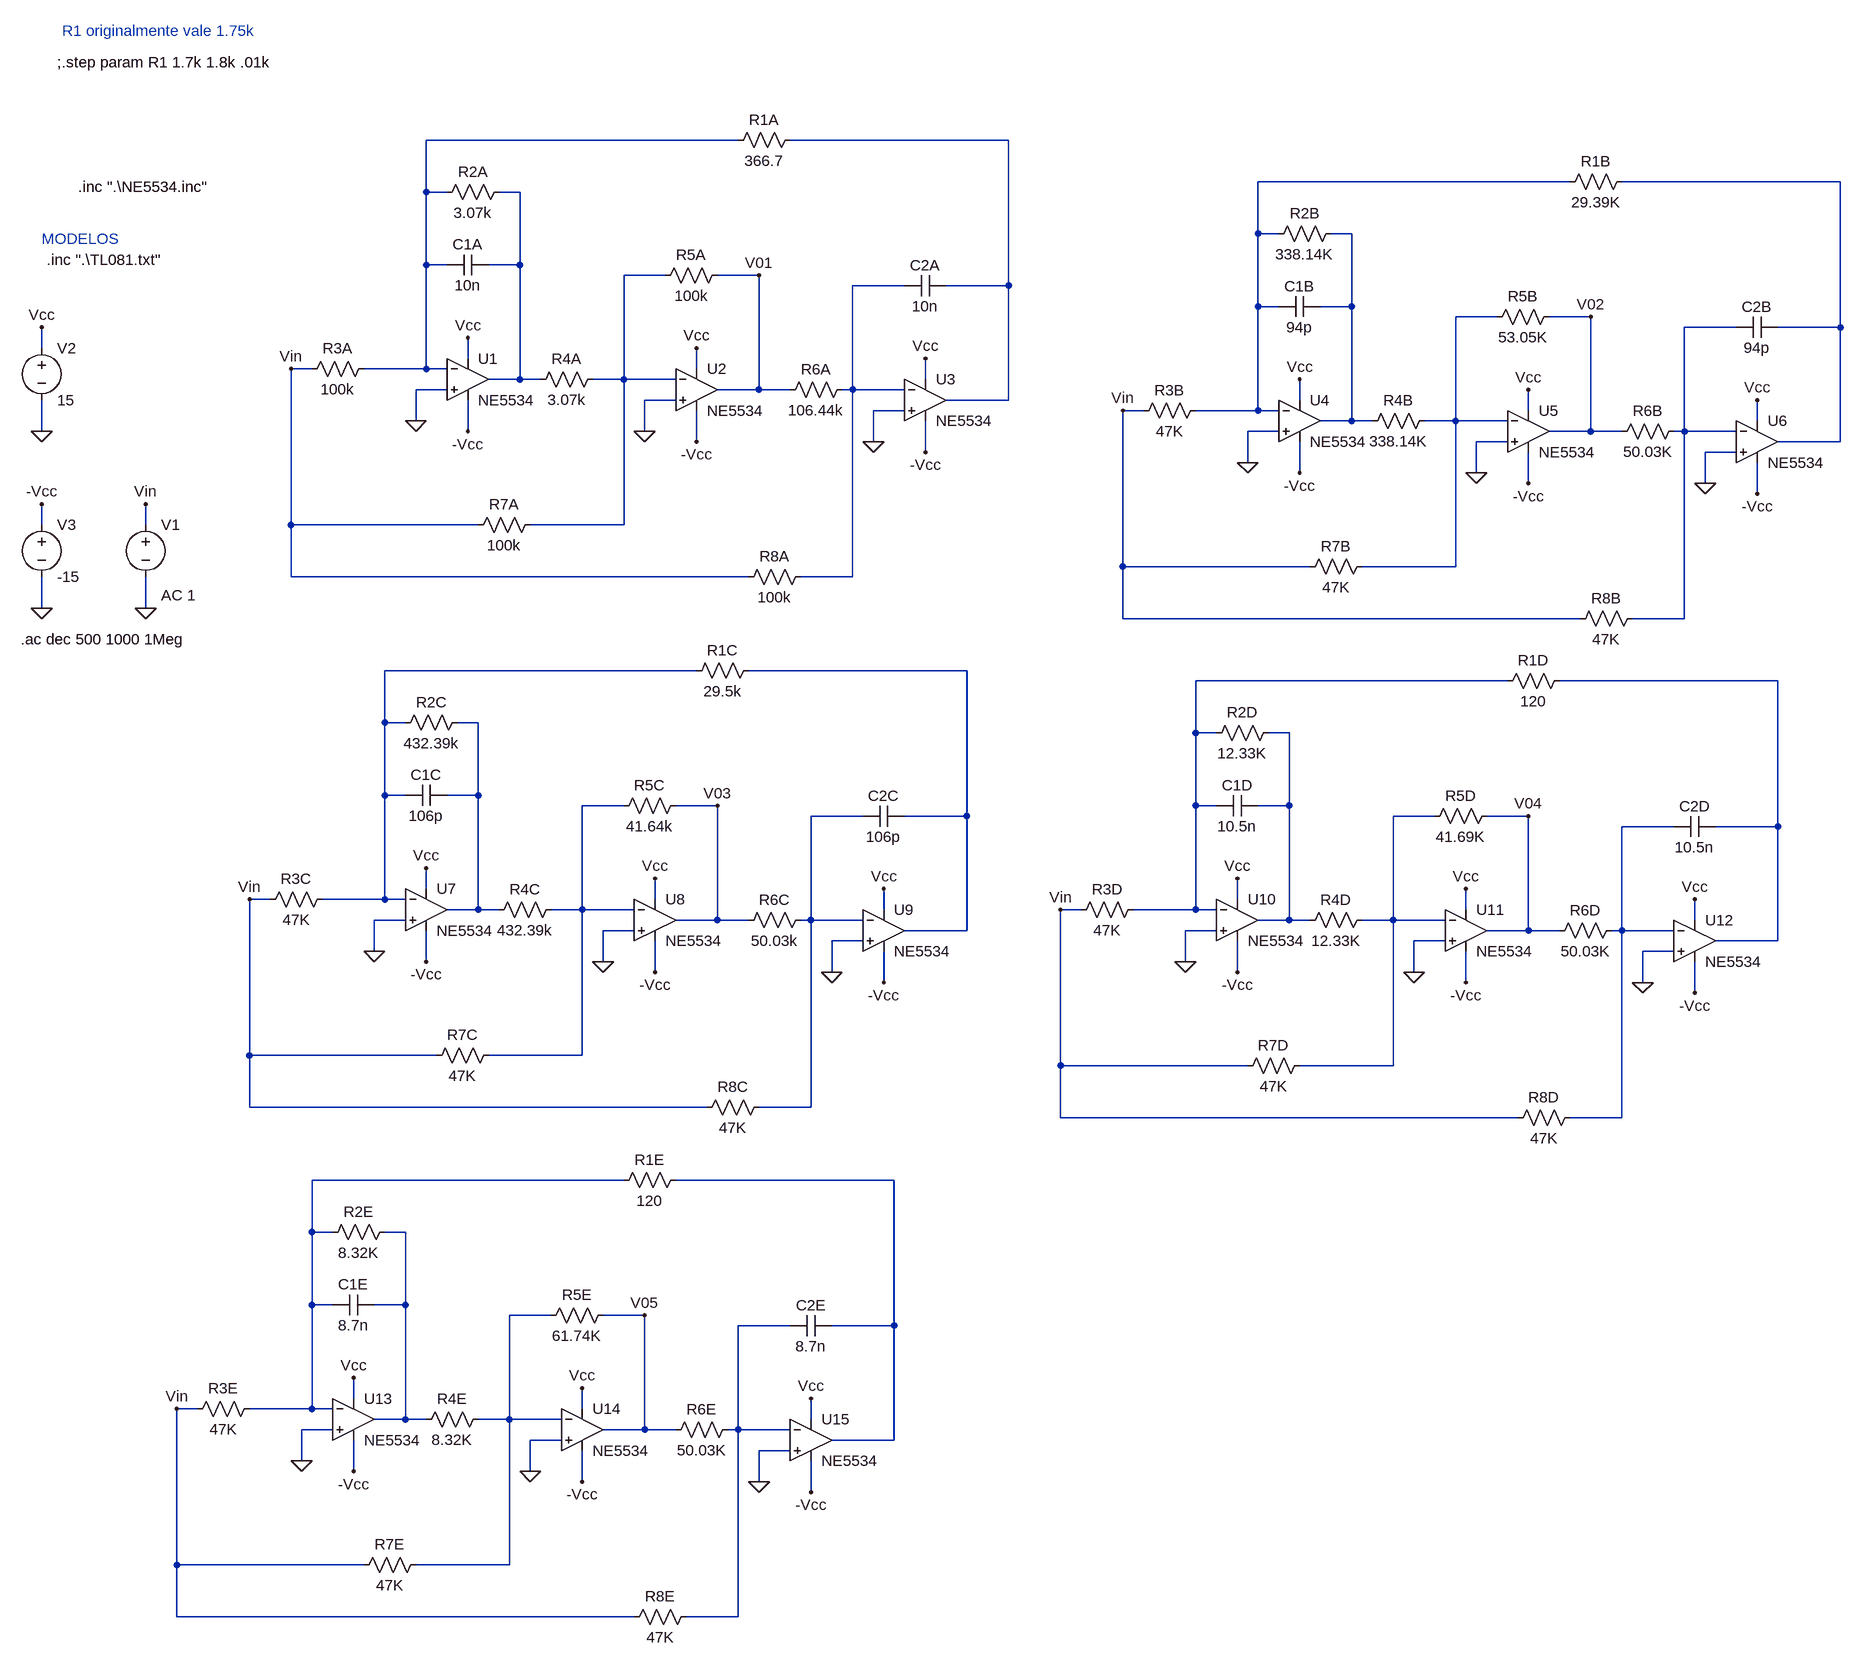
[diagram p0: schematic FT-TL081.asc]
FT-TL081.asc, the LTspice schematic file:
Version 4
SHEET 1 2736 1840
WIRE 800 -480 320 -480
WIRE 1216 -480 880 -480
WIRE 2080 -416 1600 -416
WIRE 2496 -416 2160 -416
WIRE 320 -400 320 -480
WIRE 352 -400 320 -400
WIRE 464 -400 432 -400
WIRE 1600 -336 1600 -416
WIRE 1632 -336 1600 -336
WIRE 1744 -336 1712 -336
WIRE 320 -288 320 -400
WIRE 352 -288 320 -288
WIRE 464 -288 464 -400
WIRE 464 -288 416 -288
WIRE 688 -272 624 -272
WIRE 832 -272 768 -272
WIRE 1056 -256 976 -256
WIRE 1216 -256 1216 -480
WIRE 1216 -256 1120 -256
WIRE 1600 -224 1600 -336
WIRE 1632 -224 1600 -224
WIRE 1744 -224 1744 -336
WIRE 1744 -224 1696 -224
WIRE 1968 -208 1904 -208
WIRE 2112 -208 2048 -208
WIRE 2336 -192 2256 -192
WIRE 2496 -192 2496 -416
WIRE 2496 -192 2400 -192
WIRE -272 -160 -272 -192
WIRE 384 -144 384 -176
WIRE 144 -128 112 -128
WIRE 320 -128 320 -288
WIRE 320 -128 224 -128
WIRE 352 -128 320 -128
WIRE 736 -128 736 -160
WIRE 464 -112 464 -288
WIRE 464 -112 416 -112
WIRE 496 -112 464 -112
WIRE 624 -112 624 -272
WIRE 624 -112 576 -112
WIRE 704 -112 624 -112
WIRE 1088 -112 1088 -144
WIRE 352 -96 304 -96
WIRE 832 -96 832 -272
WIRE 832 -96 768 -96
WIRE 880 -96 832 -96
WIRE 976 -96 976 -256
WIRE 976 -96 960 -96
WIRE 1056 -96 976 -96
WIRE 704 -80 656 -80
WIRE 1216 -80 1216 -256
WIRE 1216 -80 1120 -80
WIRE 1664 -80 1664 -112
WIRE 1056 -64 1008 -64
WIRE 1424 -64 1392 -64
WIRE 1600 -64 1600 -224
WIRE 1600 -64 1504 -64
WIRE 1632 -64 1600 -64
WIRE 2016 -64 2016 -96
WIRE 304 -48 304 -96
WIRE 1744 -48 1744 -224
WIRE 1744 -48 1696 -48
WIRE 1776 -48 1744 -48
WIRE 1904 -48 1904 -208
WIRE 1904 -48 1856 -48
WIRE 1984 -48 1904 -48
WIRE 2368 -48 2368 -80
WIRE -272 -32 -272 -80
WIRE 384 -32 384 -80
WIRE 656 -32 656 -80
WIRE 1632 -32 1584 -32
WIRE 2112 -32 2112 -208
WIRE 2112 -32 2048 -32
WIRE 2160 -32 2112 -32
WIRE 2256 -32 2256 -192
WIRE 2256 -32 2240 -32
WIRE 2336 -32 2256 -32
WIRE 736 -16 736 -64
WIRE 1008 -16 1008 -64
WIRE 1984 -16 1936 -16
WIRE 2496 -16 2496 -192
WIRE 2496 -16 2400 -16
WIRE 1088 0 1088 -48
WIRE 2336 0 2288 0
WIRE 1584 16 1584 -32
WIRE 1664 32 1664 -16
WIRE 1936 32 1936 -16
WIRE 2016 48 2016 0
WIRE 2288 48 2288 0
WIRE 2368 64 2368 16
WIRE -272 112 -272 80
WIRE -112 112 -112 80
WIRE 112 112 112 -128
WIRE 400 112 112 112
WIRE 624 112 624 -112
WIRE 624 112 480 112
WIRE 1392 176 1392 -64
WIRE 1680 176 1392 176
WIRE 1904 176 1904 -48
WIRE 1904 176 1760 176
WIRE 112 192 112 112
WIRE 816 192 112 192
WIRE 976 192 976 -96
WIRE 976 192 896 192
WIRE -272 240 -272 192
WIRE -112 240 -112 192
WIRE 1392 256 1392 176
WIRE 2096 256 1392 256
WIRE 2256 256 2256 -32
WIRE 2256 256 2176 256
WIRE 736 336 256 336
WIRE 1152 336 816 336
WIRE 1984 352 1504 352
WIRE 2400 352 2064 352
WIRE 256 416 256 336
WIRE 288 416 256 416
WIRE 400 416 368 416
WIRE 1504 432 1504 352
WIRE 1536 432 1504 432
WIRE 1648 432 1616 432
WIRE 256 528 256 416
WIRE 288 528 256 528
WIRE 400 528 400 416
WIRE 400 528 352 528
WIRE 624 544 560 544
WIRE 768 544 704 544
WIRE 1504 544 1504 432
WIRE 1536 544 1504 544
WIRE 1648 544 1648 432
WIRE 1648 544 1600 544
WIRE 992 560 912 560
WIRE 1152 560 1152 336
WIRE 1152 560 1056 560
WIRE 1872 560 1808 560
WIRE 2016 560 1952 560
WIRE 2240 576 2160 576
WIRE 2400 576 2400 352
WIRE 2400 576 2304 576
WIRE 320 672 320 640
WIRE 80 688 48 688
WIRE 256 688 256 528
WIRE 256 688 160 688
WIRE 288 688 256 688
WIRE 672 688 672 656
WIRE 1568 688 1568 656
WIRE 400 704 400 528
WIRE 400 704 352 704
WIRE 432 704 400 704
WIRE 560 704 560 544
WIRE 560 704 512 704
WIRE 640 704 560 704
WIRE 1024 704 1024 672
WIRE 1328 704 1296 704
WIRE 1504 704 1504 544
WIRE 1504 704 1408 704
WIRE 1536 704 1504 704
WIRE 1920 704 1920 672
WIRE 288 720 240 720
WIRE 768 720 768 544
WIRE 768 720 704 720
WIRE 816 720 768 720
WIRE 912 720 912 560
WIRE 912 720 896 720
WIRE 992 720 912 720
WIRE 1648 720 1648 544
WIRE 1648 720 1600 720
WIRE 1680 720 1648 720
WIRE 1808 720 1808 560
WIRE 1808 720 1760 720
WIRE 1888 720 1808 720
WIRE 2272 720 2272 688
WIRE 640 736 592 736
WIRE 1152 736 1152 560
WIRE 1152 736 1056 736
WIRE 1536 736 1488 736
WIRE 2016 736 2016 560
WIRE 2016 736 1952 736
WIRE 2064 736 2016 736
WIRE 2160 736 2160 576
WIRE 2160 736 2144 736
WIRE 2240 736 2160 736
WIRE 992 752 944 752
WIRE 1888 752 1840 752
WIRE 2400 752 2400 576
WIRE 2400 752 2304 752
WIRE 240 768 240 720
WIRE 2240 768 2192 768
WIRE 320 784 320 736
WIRE 592 784 592 736
WIRE 1488 784 1488 736
WIRE 672 800 672 752
WIRE 944 800 944 752
WIRE 1568 800 1568 752
WIRE 1840 800 1840 752
WIRE 1024 816 1024 768
WIRE 1920 816 1920 768
WIRE 2192 816 2192 768
WIRE 2272 832 2272 784
WIRE 48 928 48 688
WIRE 336 928 48 928
WIRE 560 928 560 704
WIRE 560 928 416 928
WIRE 1296 944 1296 704
WIRE 1584 944 1296 944
WIRE 1808 944 1808 720
WIRE 1808 944 1664 944
WIRE 48 1008 48 928
WIRE 752 1008 48 1008
WIRE 912 1008 912 720
WIRE 912 1008 832 1008
WIRE 1296 1024 1296 944
WIRE 2000 1024 1296 1024
WIRE 2160 1024 2160 736
WIRE 2160 1024 2080 1024
WIRE 624 1120 144 1120
WIRE 1040 1120 704 1120
WIRE 144 1200 144 1120
WIRE 176 1200 144 1200
WIRE 288 1200 256 1200
WIRE 144 1312 144 1200
WIRE 176 1312 144 1312
WIRE 288 1312 288 1200
WIRE 288 1312 240 1312
WIRE 512 1328 448 1328
WIRE 656 1328 592 1328
WIRE 880 1344 800 1344
WIRE 1040 1344 1040 1120
WIRE 1040 1344 944 1344
WIRE 208 1456 208 1424
WIRE -32 1472 -64 1472
WIRE 144 1472 144 1312
WIRE 144 1472 48 1472
WIRE 176 1472 144 1472
WIRE 560 1472 560 1440
WIRE 288 1488 288 1312
WIRE 288 1488 240 1488
WIRE 320 1488 288 1488
WIRE 448 1488 448 1328
WIRE 448 1488 400 1488
WIRE 528 1488 448 1488
WIRE 912 1488 912 1456
WIRE 176 1504 128 1504
WIRE 656 1504 656 1328
WIRE 656 1504 592 1504
WIRE 704 1504 656 1504
WIRE 800 1504 800 1344
WIRE 800 1504 784 1504
WIRE 880 1504 800 1504
WIRE 528 1520 480 1520
WIRE 1040 1520 1040 1344
WIRE 1040 1520 944 1520
WIRE 880 1536 832 1536
WIRE 128 1552 128 1504
WIRE 208 1568 208 1520
WIRE 480 1568 480 1520
WIRE 560 1584 560 1536
WIRE 832 1584 832 1536
WIRE 912 1600 912 1552
WIRE -64 1712 -64 1472
WIRE 224 1712 -64 1712
WIRE 448 1712 448 1488
WIRE 448 1712 304 1712
WIRE -64 1792 -64 1712
WIRE 640 1792 -64 1792
WIRE 800 1792 800 1504
WIRE 800 1792 720 1792
FLAG -272 80 -Vcc
FLAG -272 -192 Vcc
FLAG -272 -32 0
FLAG -272 240 0
FLAG 384 -176 Vcc
FLAG 384 -32 -Vcc
FLAG 304 -48 0
FLAG 736 -160 Vcc
FLAG 736 -16 -Vcc
FLAG 656 -32 0
FLAG 1088 -144 Vcc
FLAG 1088 0 -Vcc
FLAG 1008 -16 0
FLAG -112 240 0
FLAG -112 80 Vin
FLAG 112 -128 Vin
FLAG 832 -272 V01
FLAG 1664 -112 Vcc
FLAG 1664 32 -Vcc
FLAG 1584 16 0
FLAG 2016 -96 Vcc
FLAG 2016 48 -Vcc
FLAG 1936 32 0
FLAG 2368 -80 Vcc
FLAG 2368 64 -Vcc
FLAG 2288 48 0
FLAG 1392 -64 Vin
FLAG 2112 -208 V02
FLAG 320 640 Vcc
FLAG 320 784 -Vcc
FLAG 240 768 0
FLAG 672 656 Vcc
FLAG 672 800 -Vcc
FLAG 592 784 0
FLAG 1024 672 Vcc
FLAG 1024 816 -Vcc
FLAG 944 800 0
FLAG 48 688 Vin
FLAG 768 544 V03
FLAG 1568 656 Vcc
FLAG 1568 800 -Vcc
FLAG 1488 784 0
FLAG 1920 672 Vcc
FLAG 1920 816 -Vcc
FLAG 1840 800 0
FLAG 2272 688 Vcc
FLAG 2272 832 -Vcc
FLAG 2192 816 0
FLAG 1296 704 Vin
FLAG 2016 560 V04
FLAG 208 1424 Vcc
FLAG 208 1568 -Vcc
FLAG 128 1552 0
FLAG 560 1440 Vcc
FLAG 560 1584 -Vcc
FLAG 480 1568 0
FLAG 912 1456 Vcc
FLAG 912 1600 -Vcc
FLAG 832 1584 0
FLAG -64 1472 Vin
FLAG 656 1328 V05
SYMBOL voltage -272 -176 R0
SYMATTR InstName V2
SYMATTR Value 15
SYMBOL voltage -272 96 R0
SYMATTR InstName V3
SYMATTR Value -15
SYMBOL Opamps\\opamp2 384 -176 R0
SYMATTR InstName U1
SYMATTR Value NE5534
SYMBOL cap 416 -304 R90
WINDOW 0 0 32 VBottom 2
WINDOW 3 32 32 VTop 2
SYMATTR InstName C1A
SYMATTR Value 10n
SYMBOL res 896 -496 R90
WINDOW 0 0 56 VBottom 2
WINDOW 3 32 56 VTop 2
SYMATTR InstName R1A
SYMATTR Value 366.7
SYMBOL res 448 -416 R90
WINDOW 0 0 56 VBottom 2
WINDOW 3 32 56 VTop 2
SYMATTR InstName R2A
SYMATTR Value 3.07k
SYMBOL res 240 -144 R90
WINDOW 0 0 56 VBottom 2
WINDOW 3 32 56 VTop 2
SYMATTR InstName R3A
SYMATTR Value 100k
SYMBOL res 592 -128 R90
WINDOW 0 0 56 VBottom 2
WINDOW 3 32 56 VTop 2
SYMATTR InstName R4A
SYMATTR Value 3.07k
SYMBOL res 784 -288 R90
WINDOW 0 0 56 VBottom 2
WINDOW 3 32 56 VTop 2
SYMATTR InstName R5A
SYMATTR Value 100k
SYMBOL res 976 -112 R90
WINDOW 0 0 56 VBottom 2
WINDOW 3 32 56 VTop 2
SYMATTR InstName R6A
SYMATTR Value 106.44k
SYMBOL res 496 96 R90
WINDOW 0 0 56 VBottom 2
WINDOW 3 32 56 VTop 2
SYMATTR InstName R7A
SYMATTR Value 100k
SYMBOL res 912 176 R90
WINDOW 0 0 56 VBottom 2
WINDOW 3 32 56 VTop 2
SYMATTR InstName R8A
SYMATTR Value 100k
SYMBOL cap 1120 -272 R90
WINDOW 0 0 32 VBottom 2
WINDOW 3 32 32 VTop 2
SYMATTR InstName C2A
SYMATTR Value 10n
SYMBOL voltage -112 96 R0
WINDOW 123 24 124 Left 2
WINDOW 39 0 0 Left 0
SYMATTR Value2 AC 1
SYMATTR InstName V1
SYMATTR Value ""
SYMBOL Opamps\\opamp2 736 -160 R0
SYMATTR InstName U2
SYMATTR Value NE5534
SYMBOL Opamps\\opamp2 1088 -144 R0
SYMATTR InstName U3
SYMATTR Value NE5534
SYMBOL Opamps\\opamp2 1664 -112 R0
SYMATTR InstName U4
SYMATTR Value NE5534
SYMBOL cap 1696 -240 R90
WINDOW 0 0 32 VBottom 2
WINDOW 3 32 32 VTop 2
SYMATTR InstName C1B
SYMATTR Value 94p
SYMBOL res 2176 -432 R90
WINDOW 0 0 56 VBottom 2
WINDOW 3 32 56 VTop 2
SYMATTR InstName R1B
SYMATTR Value 29.39K
SYMBOL res 1728 -352 R90
WINDOW 0 0 56 VBottom 2
WINDOW 3 32 56 VTop 2
SYMATTR InstName R2B
SYMATTR Value 338.14K
SYMBOL res 1520 -80 R90
WINDOW 0 0 56 VBottom 2
WINDOW 3 32 56 VTop 2
SYMATTR InstName R3B
SYMATTR Value 47K
SYMBOL res 1872 -64 R90
WINDOW 0 0 56 VBottom 2
WINDOW 3 32 56 VTop 2
SYMATTR InstName R4B
SYMATTR Value 338.14K
SYMBOL res 2064 -224 R90
WINDOW 0 0 56 VBottom 2
WINDOW 3 32 56 VTop 2
SYMATTR InstName R5B
SYMATTR Value 53.05K
SYMBOL res 2256 -48 R90
WINDOW 0 0 56 VBottom 2
WINDOW 3 32 56 VTop 2
SYMATTR InstName R6B
SYMATTR Value 50.03K
SYMBOL res 1776 160 R90
WINDOW 0 0 56 VBottom 2
WINDOW 3 32 56 VTop 2
SYMATTR InstName R7B
SYMATTR Value 47K
SYMBOL res 2192 240 R90
WINDOW 0 0 56 VBottom 2
WINDOW 3 32 56 VTop 2
SYMATTR InstName R8B
SYMATTR Value 47K
SYMBOL cap 2400 -208 R90
WINDOW 0 0 32 VBottom 2
WINDOW 3 32 32 VTop 2
SYMATTR InstName C2B
SYMATTR Value 94p
SYMBOL Opamps\\opamp2 2016 -96 R0
SYMATTR InstName U5
SYMATTR Value NE5534
SYMBOL Opamps\\opamp2 2368 -80 R0
SYMATTR InstName U6
SYMATTR Value NE5534
SYMBOL Opamps\\opamp2 320 640 R0
SYMATTR InstName U7
SYMATTR Value NE5534
SYMBOL cap 352 512 R90
WINDOW 0 0 32 VBottom 2
WINDOW 3 32 32 VTop 2
SYMATTR InstName C1C
SYMATTR Value 106p
SYMBOL res 832 320 R90
WINDOW 0 0 56 VBottom 2
WINDOW 3 32 56 VTop 2
SYMATTR InstName R1C
SYMATTR Value 29.5k
SYMBOL res 384 400 R90
WINDOW 0 0 56 VBottom 2
WINDOW 3 32 56 VTop 2
SYMATTR InstName R2C
SYMATTR Value 432.39k
SYMBOL res 176 672 R90
WINDOW 0 0 56 VBottom 2
WINDOW 3 32 56 VTop 2
SYMATTR InstName R3C
SYMATTR Value 47K
SYMBOL res 528 688 R90
WINDOW 0 0 56 VBottom 2
WINDOW 3 32 56 VTop 2
SYMATTR InstName R4C
SYMATTR Value 432.39k
SYMBOL res 720 528 R90
WINDOW 0 0 56 VBottom 2
WINDOW 3 32 56 VTop 2
SYMATTR InstName R5C
SYMATTR Value 41.64k
SYMBOL res 912 704 R90
WINDOW 0 0 56 VBottom 2
WINDOW 3 32 56 VTop 2
SYMATTR InstName R6C
SYMATTR Value 50.03k
SYMBOL res 432 912 R90
WINDOW 0 0 56 VBottom 2
WINDOW 3 32 56 VTop 2
SYMATTR InstName R7C
SYMATTR Value 47K
SYMBOL res 848 992 R90
WINDOW 0 0 56 VBottom 2
WINDOW 3 32 56 VTop 2
SYMATTR InstName R8C
SYMATTR Value 47K
SYMBOL cap 1056 544 R90
WINDOW 0 0 32 VBottom 2
WINDOW 3 32 32 VTop 2
SYMATTR InstName C2C
SYMATTR Value 106p
SYMBOL Opamps\\opamp2 672 656 R0
SYMATTR InstName U8
SYMATTR Value NE5534
SYMBOL Opamps\\opamp2 1024 672 R0
SYMATTR InstName U9
SYMATTR Value NE5534
SYMBOL Opamps\\opamp2 1568 656 R0
SYMATTR InstName U10
SYMATTR Value NE5534
SYMBOL cap 1600 528 R90
WINDOW 0 0 32 VBottom 2
WINDOW 3 32 32 VTop 2
SYMATTR InstName C1D
SYMATTR Value 10.5n
SYMBOL res 2080 336 R90
WINDOW 0 0 56 VBottom 2
WINDOW 3 32 56 VTop 2
SYMATTR InstName R1D
SYMATTR Value 120
SYMBOL res 1632 416 R90
WINDOW 0 0 56 VBottom 2
WINDOW 3 32 56 VTop 2
SYMATTR InstName R2D
SYMATTR Value 12.33K
SYMBOL res 1424 688 R90
WINDOW 0 0 56 VBottom 2
WINDOW 3 32 56 VTop 2
SYMATTR InstName R3D
SYMATTR Value 47K
SYMBOL res 1776 704 R90
WINDOW 0 0 56 VBottom 2
WINDOW 3 32 56 VTop 2
SYMATTR InstName R4D
SYMATTR Value 12.33K
SYMBOL res 1968 544 R90
WINDOW 0 0 56 VBottom 2
WINDOW 3 32 56 VTop 2
SYMATTR InstName R5D
SYMATTR Value 41.69K
SYMBOL res 2160 720 R90
WINDOW 0 0 56 VBottom 2
WINDOW 3 32 56 VTop 2
SYMATTR InstName R6D
SYMATTR Value 50.03K
SYMBOL res 1680 928 R90
WINDOW 0 0 56 VBottom 2
WINDOW 3 32 56 VTop 2
SYMATTR InstName R7D
SYMATTR Value 47K
SYMBOL res 2096 1008 R90
WINDOW 0 0 56 VBottom 2
WINDOW 3 32 56 VTop 2
SYMATTR InstName R8D
SYMATTR Value 47K
SYMBOL cap 2304 560 R90
WINDOW 0 0 32 VBottom 2
WINDOW 3 32 32 VTop 2
SYMATTR InstName C2D
SYMATTR Value 10.5n
SYMBOL Opamps\\opamp2 1920 672 R0
SYMATTR InstName U11
SYMATTR Value NE5534
SYMBOL Opamps\\opamp2 2272 688 R0
SYMATTR InstName U12
SYMATTR Value NE5534
SYMBOL Opamps\\opamp2 208 1424 R0
SYMATTR InstName U13
SYMATTR Value NE5534
SYMBOL cap 240 1296 R90
WINDOW 0 0 32 VBottom 2
WINDOW 3 32 32 VTop 2
SYMATTR InstName C1E
SYMATTR Value 8.7n
SYMBOL res 720 1104 R90
WINDOW 0 0 56 VBottom 2
WINDOW 3 32 56 VTop 2
SYMATTR InstName R1E
SYMATTR Value 120
SYMBOL res 272 1184 R90
WINDOW 0 0 56 VBottom 2
WINDOW 3 32 56 VTop 2
SYMATTR InstName R2E
SYMATTR Value 8.32K
SYMBOL res 64 1456 R90
WINDOW 0 0 56 VBottom 2
WINDOW 3 32 56 VTop 2
SYMATTR InstName R3E
SYMATTR Value 47K
SYMBOL res 416 1472 R90
WINDOW 0 0 56 VBottom 2
WINDOW 3 32 56 VTop 2
SYMATTR InstName R4E
SYMATTR Value 8.32K
SYMBOL res 608 1312 R90
WINDOW 0 0 56 VBottom 2
WINDOW 3 32 56 VTop 2
SYMATTR InstName R5E
SYMATTR Value 61.74K
SYMBOL res 800 1488 R90
WINDOW 0 0 56 VBottom 2
WINDOW 3 32 56 VTop 2
SYMATTR InstName R6E
SYMATTR Value 50.03K
SYMBOL res 320 1696 R90
WINDOW 0 0 56 VBottom 2
WINDOW 3 32 56 VTop 2
SYMATTR InstName R7E
SYMATTR Value 47K
SYMBOL res 736 1776 R90
WINDOW 0 0 56 VBottom 2
WINDOW 3 32 56 VTop 2
SYMATTR InstName R8E
SYMATTR Value 47K
SYMBOL cap 944 1328 R90
WINDOW 0 0 32 VBottom 2
WINDOW 3 32 32 VTop 2
SYMATTR InstName C2E
SYMATTR Value 8.7n
SYMBOL Opamps\\opamp2 560 1440 R0
SYMATTR InstName U14
SYMATTR Value NE5534
SYMBOL Opamps\\opamp2 912 1456 R0
SYMATTR InstName U15
SYMATTR Value NE5534
TEXT -264 -296 Left 2 !.inc ".\\TL081.txt"
TEXT -272 -328 Left 2 ;MODELOS
TEXT -248 -600 Left 2 !;.step param R1 1.7k 1.8k .01k
TEXT -240 -648 Left 2 ;R1 originalmente vale 1.75k
TEXT -304 288 Left 2 !.ac dec 500 1000 1Meg
TEXT -216 -408 Left 2 !.inc ".\\NE5534.inc"

The netlist it stands for:
* FT-TL081.asc
V2 Vcc 0 15
V3 -Vcc 0 -15
XU1 0 N001 Vcc -Vcc N005 NE5534  ; pins In+ In- V+ V- OUT
C1A N005 N001 10n
R1A N002 N001 366.7
R2A N005 N001 3.07k
R3A N001 Vin 100k
R4A N007 N005 3.07k
R5A V01 N007 100k
R6A N008 V01 106.44k
R7A N007 Vin 100k
R8A N008 Vin 100k
C2A N002 N008 10n
V1 Vin 0 AC 1
XU2 0 N007 Vcc -Vcc V01 NE5534  ; pins In+ In- V+ V- OUT
XU3 0 N008 Vcc -Vcc N002 NE5534  ; pins In+ In- V+ V- OUT
XU4 0 N003 Vcc -Vcc N006 NE5534  ; pins In+ In- V+ V- OUT
C1B N006 N003 94p
R1B N004 N003 29.39K
R2B N006 N003 338.14K
R3B N003 Vin 47K
R4B N009 N006 338.14K
R5B V02 N009 53.05K
R6B N010 V02 50.03K
R7B N009 Vin 47K
R8B N010 Vin 47K
C2B N004 N010 94p
XU5 0 N009 Vcc -Vcc V02 NE5534  ; pins In+ In- V+ V- OUT
XU6 0 N010 Vcc -Vcc N004 NE5534  ; pins In+ In- V+ V- OUT
XU7 0 N011 Vcc -Vcc N015 NE5534  ; pins In+ In- V+ V- OUT
C1C N015 N011 106p
R1C N012 N011 29.5k
R2C N015 N011 432.39k
R3C N011 Vin 47K
R4C N017 N015 432.39k
R5C V03 N017 41.64k
R6C N018 V03 50.03k
R7C N017 Vin 47K
R8C N018 Vin 47K
C2C N012 N018 106p
XU8 0 N017 Vcc -Vcc V03 NE5534  ; pins In+ In- V+ V- OUT
XU9 0 N018 Vcc -Vcc N012 NE5534  ; pins In+ In- V+ V- OUT
XU10 0 N013 Vcc -Vcc N016 NE5534  ; pins In+ In- V+ V- OUT
C1D N016 N013 10.5n
R1D N014 N013 120
R2D N016 N013 12.33K
R3D N013 Vin 47K
R4D N019 N016 12.33K
R5D V04 N019 41.69K
R6D N020 V04 50.03K
R7D N019 Vin 47K
R8D N020 Vin 47K
C2D N014 N020 10.5n
XU11 0 N019 Vcc -Vcc V04 NE5534  ; pins In+ In- V+ V- OUT
XU12 0 N020 Vcc -Vcc N014 NE5534  ; pins In+ In- V+ V- OUT
XU13 0 N021 Vcc -Vcc N023 NE5534  ; pins In+ In- V+ V- OUT
C1E N023 N021 8.7n
R1E N022 N021 120
R2E N023 N021 8.32K
R3E N021 Vin 47K
R4E N024 N023 8.32K
R5E V05 N024 61.74K
R6E N025 V05 50.03K
R7E N024 Vin 47K
R8E N025 Vin 47K
C2E N022 N025 8.7n
XU14 0 N024 Vcc -Vcc V05 NE5534  ; pins In+ In- V+ V- OUT
XU15 0 N025 Vcc -Vcc N022 NE5534  ; pins In+ In- V+ V- OUT
.inc ".\TL081.txt"
* MODELOS
;.step param R1 1.7k 1.8k .01k
* R1 originalmente vale 1.75k
.ac dec 500 1000 1Meg
.inc ".\NE5534.inc"
.backanno
.end